# EasyEDA Pro project ProPrj_ODrive_2025-02-24.epro, schematic ODrive1_1

## Sheets
1 Controller: Board Name: ODrive1_2; Create Date: 2025-02-06; Page Name: Controller; Project Name: ODrive; Schematic Name: ODrive1_2; Update Date: 2025-02-06
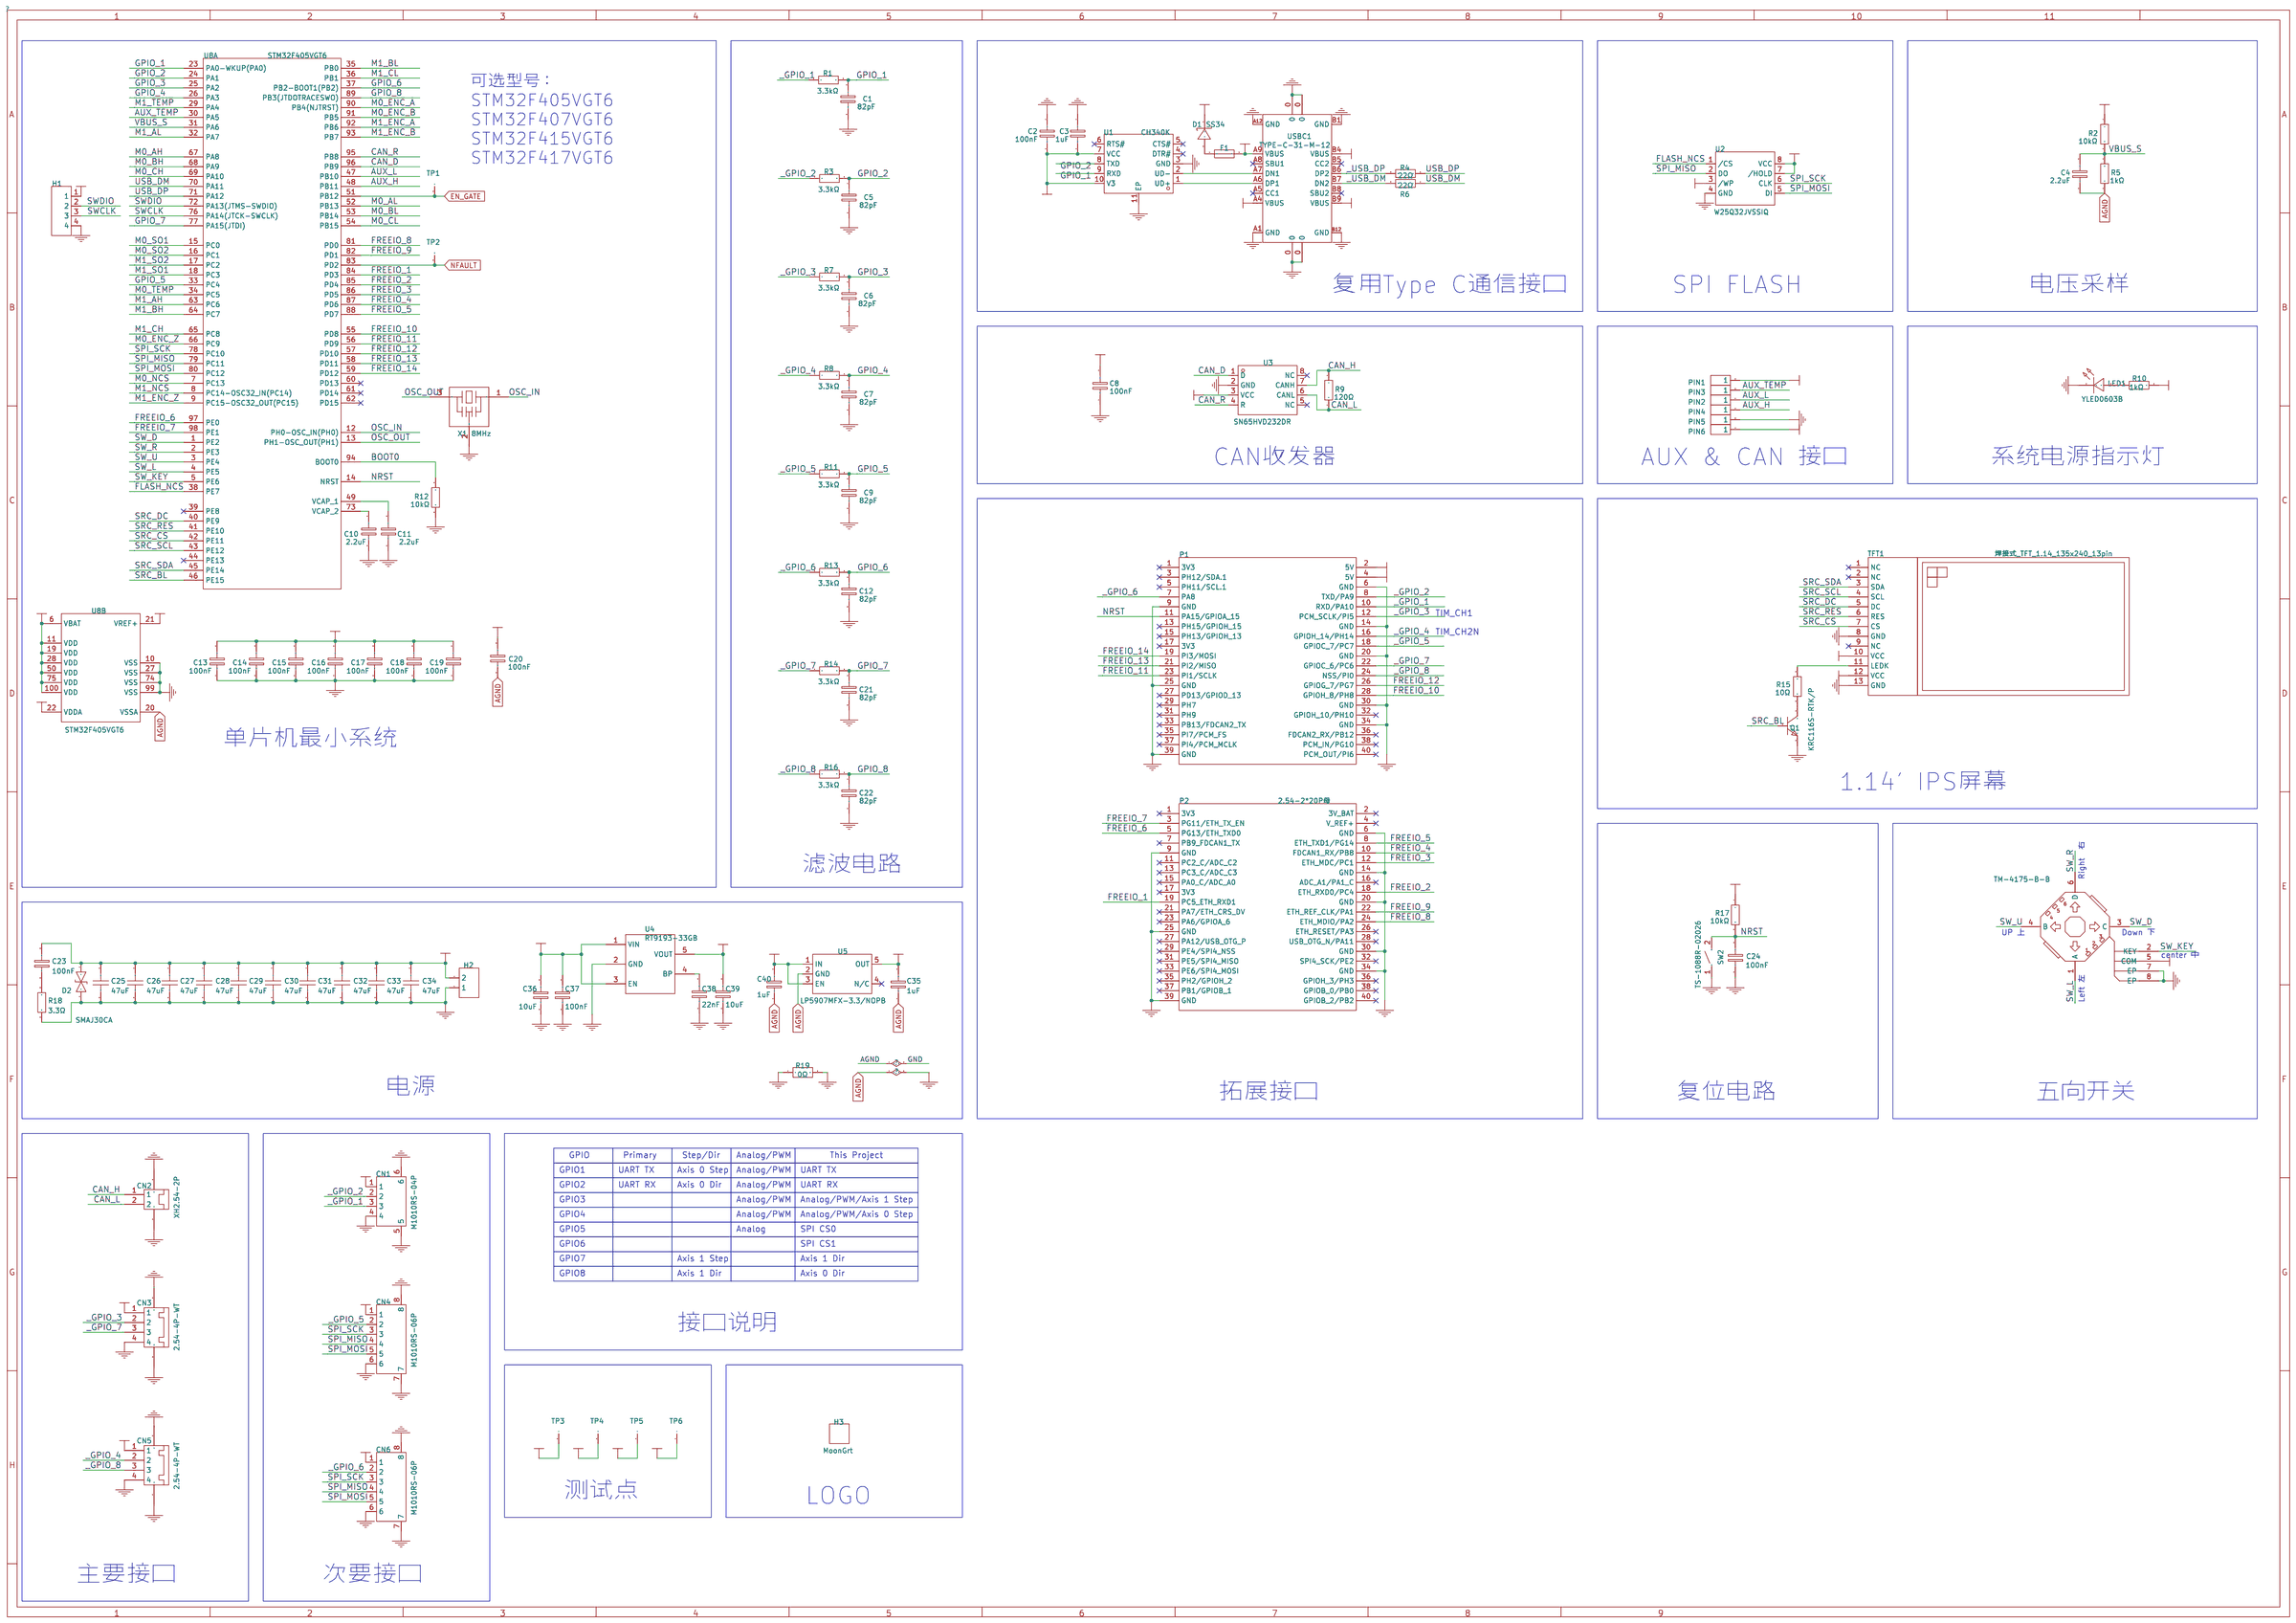
[diagram p0: Controller]
2 Motor: Page Name: Motor
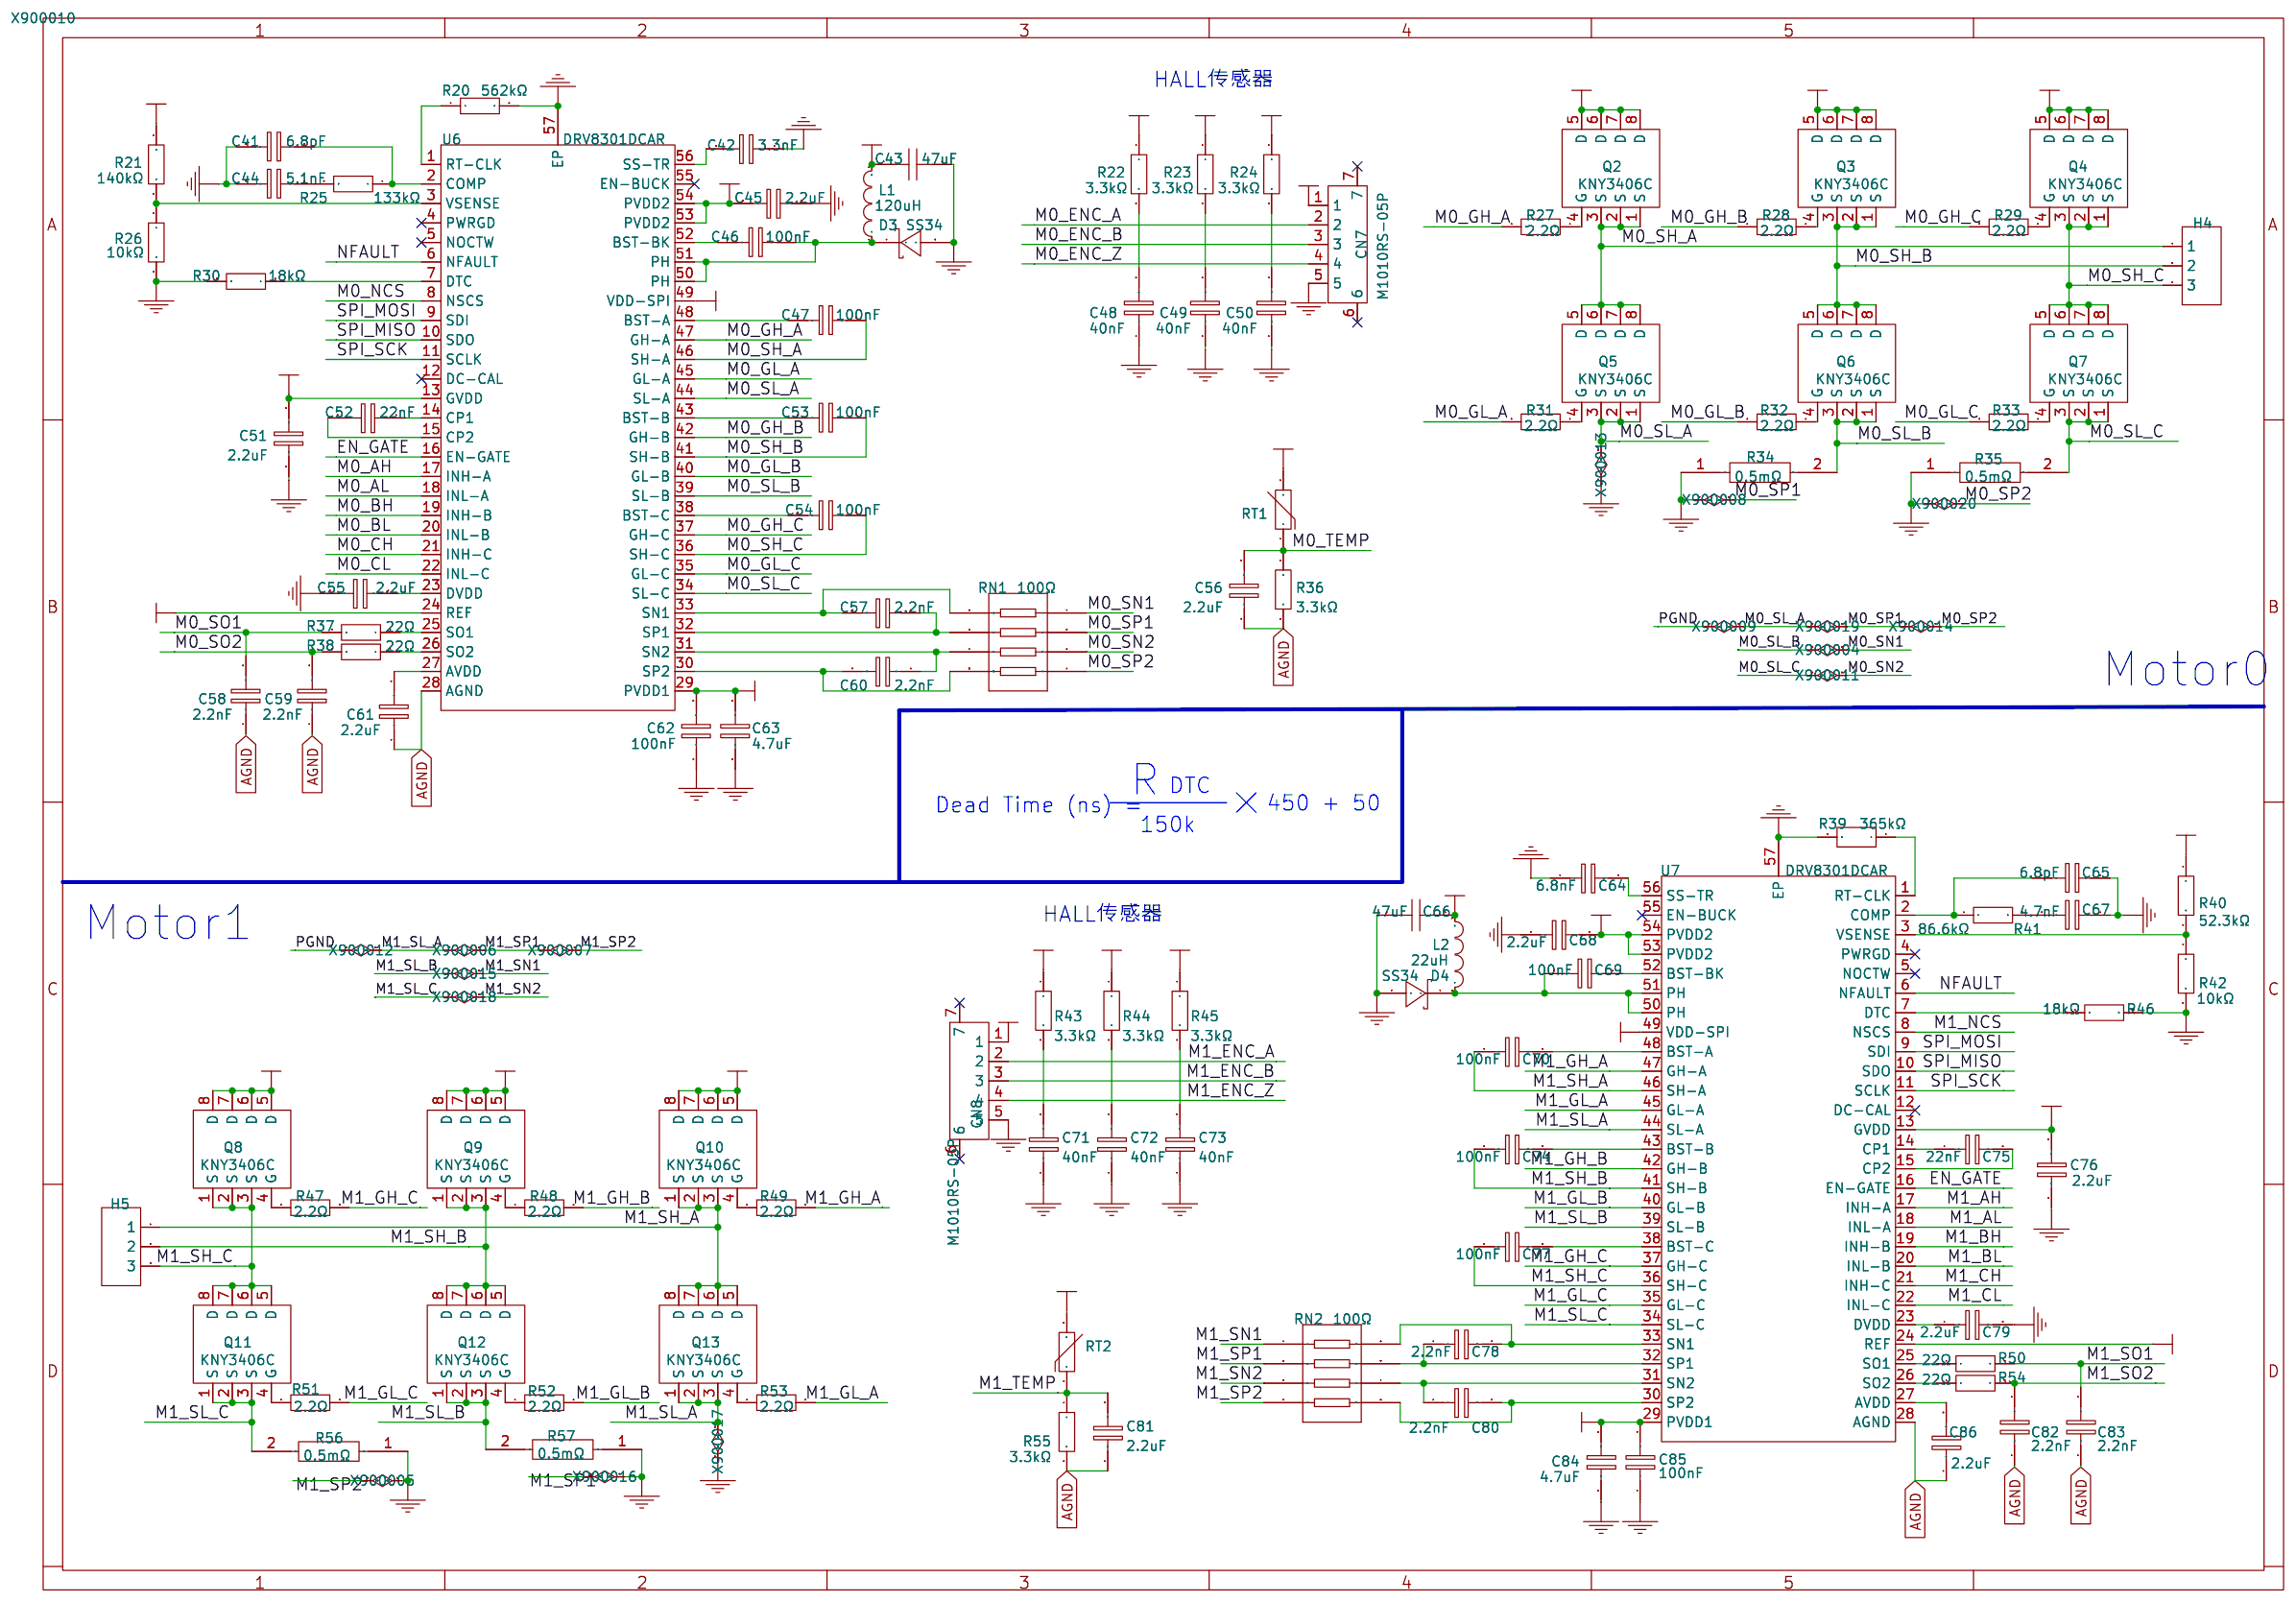
[diagram p1: Motor]

## Parts
sheet Controller
C1  82pF  [C0603]
C2  100nF  [C0603]
C3  1uF  [C0603]
C4  2.2uF  [C0603]
C5  82pF  [C0603]
C6  82pF  [C0603]
C7  82pF  [C0603]
C8  100nF  [C0603]
C9  82pF  [C0603]
C10  2.2uF  [C0603]
C11  2.2uF  [C0603]
C12  82pF  [C0603]
C13  100nF  [C0603]
C14  100nF  [C0603]
C15  100nF  [C0603]
C16  100nF  [C0603]
C17  100nF  [C0603]
C18  100nF  [C0603]
C19  100nF  [C0603]
C20  100nF  [C0603]
C21  82pF  [C0603]
C22  82pF  [C0603]
C23  100nF  [C0603]
C24  100nF  [C0603]
C25  47uF  [C1812]
C26  47uF  [C1812]
C27  47uF  [C1812]
C28  47uF  [C1812]
C29  47uF  [C1812]
C30  47uF  [C1812]
C31  47uF  [C1812]
C32  47uF  [C1812]
C33  47uF  [C1812]
C34  47uF  [C1812]
C35  1uF  [C0603]
C36  10uF  [C0603]
C37  100nF  [C0603]
C38  22nF  [C0603]
C39  10uF  [C0603]
C40  1uF  [C0603]
CN1  M1010RS-04P  [CONN-SMD_M1010RS-04P]
CN2  XH2.54-2P  [CONN-SMD_2.54-2P-WT]
CN3  2.54-4P-WT  [CONN-SMD_2.54-4P-WT]
CN4  M1010RS-06P  [CONN-SMD_M1010RS-06P]
CN5  2.54-4P-WT  [CONN-SMD_2.54-4P-WT]
CN6  M1010RS-06P  [CONN-SMD_M1010RS-06P]
D1  SS34  [SMA_L4.4-W2.8-LS5.4-RD]
D2  SMAJ30CA  [SMA_L4.4-W2.6-LS5.0-BI]
F1  FSMD012-1206-R  [F1206]
H1  PZ200V-11-04P  [HDR-TH_4P-P2.00-V-M]  (no BOM)
H2  XT30U-M  [XT30U-M]
H3  MoonGrt  [ODRIVE_LOGO_H3.5]  (no BOM)
LED1  YLED0603B  [LED0603_BLUE]
P1  2.54-2*20P母  [MY_HDR-TH_40P-P2.54-V-M-R2-C20-S2.54]
P2  2.54-2*20P母  [MY_HDR-TH_40P-P2.54-V-M-R2-C20-S2.54]
PIN1  1PIN  [1PIN]  (no BOM)
PIN2  1PIN  [1PIN]  (no BOM)
PIN3  1PIN  [1PIN]  (no BOM)
PIN4  1PIN  [1PIN]  (no BOM)
PIN5  1PIN  [1PIN]  (no BOM)
PIN6  1PIN  [1PIN]  (no BOM)
Q1  KRC116S-RTK/P  [SOT-23-3_L2.9-W1.6-P1.90-LS2.8-BR]
R1  3.3kΩ  [R0603]
R2  10kΩ  [R0603]
R3  3.3kΩ  [R0603]
R4  22Ω  [R0603]
R5  1kΩ  [R0603]
R6  22Ω  [R0603]
R7  3.3kΩ  [R0603]
R8  3.3kΩ  [R0603]
R9  120Ω  [R0603]
R10  1kΩ  [R0603]
R11  3.3kΩ  [R0603]
R12  10kΩ  [R0603]
R13  3.3kΩ  [R0603]
R14  3.3kΩ  [R0603]
R15  10Ω  [R0603]
R16  3.3kΩ  [R0603]
R17  10kΩ  [R0603]
R18  3.3Ω  [R0603]
R19  0Ω  [R0603]
SW1  TM-4175-B-B  [SW-SMD_TM-4175-B-B]
SW2  TS-1088R-02026  [SW-SMD_L3.9-W3.0-P4.45]
TFT1  焊接式_TFT_1.14_135x240_13pin  [焊接式_TFT_1.14_135X240_13PIN]
TP1  Testpoint 1.6mm  [TESTPOINT 1.6MM]  (no BOM)
TP2  Testpoint 1.6mm  [TESTPOINT 1.6MM]  (no BOM)
TP3  Testpoint 1.6mm  [TESTPOINT 1.6MM]  (no BOM)
TP4  Testpoint 1.6mm  [TESTPOINT 1.6MM]  (no BOM)
TP5  Testpoint 1.6mm  [TESTPOINT 1.6MM]  (no BOM)
TP6  Testpoint 1.6mm  [TESTPOINT 1.6MM]  (no BOM)
U1  CH340K  [ESOP-10_L4.9-W3.9-P1.00-LS6.2-BL-EP]
U2  W25Q32JVSSIQ  [SOIC-8_L5.3-W5.3-P1.27-LS8.0-BL]
U3  SN65HVD232DR  [SOIC-8_L5.0-W4.0-P1.27-LS6.0-BL]
U4  RT9193-33GB  [SOT-23-5_L3.0-W1.7-P0.95-LS2.8-BR]
U5  LP5907MFX-3.3/NOPB  [SOT-23-5_L3.0-W1.7-P0.95-LS2.8-BR]
U8  STM32F405VGT6  [LQFP-100_L14.0-W14.0-P0.50-LS16.0-BL]  (sections 1,2)
USBC1  TYPE-C-31-M-12  [USB-C_SMD-TYPE-C-31-M-12]
X1  8MHz  [OSC-SMD_3P-L3.2-W1.3-P1.20]
sheet Motor
C41  6.8pF  [C0603]
C42  3.3nF  [C0603]
C43  47uF  [C1812]
C44  5.1nF  [C0603]
C45  2.2uF  [C0603]
C46  100nF  [C0603]
C47  100nF  [C0603]
C48  40nF  [C0603]
C49  40nF  [C0603]
C50  40nF  [C0603]
C51  2.2uF  [C0603]
C52  22nF  [C0603]
C53  100nF  [C0603]
C54  100nF  [C0603]
C55  2.2uF  [C0603]
C56  2.2uF  [C0603]
C57  2.2nF  [C0603]
C58  2.2nF  [C0603]
C59  2.2nF  [C0603]
C60  2.2nF  [C0603]
C61  2.2uF  [C0603]
C62  100nF  [C0603]
C63  4.7uF  [C0603]
C64  6.8nF  [C0603]
C65  6.8pF  [C0603]
C66  47uF  [C1812]
C67  4.7nF  [C0603]
C68  2.2uF  [C0603]
C69  100nF  [C0603]
C70  100nF  [C0603]
C71  40nF  [C0603]
C72  40nF  [C0603]
C73  40nF  [C0603]
C74  100nF  [C0603]
C75  22nF  [C0603]
C76  2.2uF  [C0603]
C77  100nF  [C0603]
C78  2.2nF  [C0603]
C79  2.2uF  [C0603]
C80  2.2nF  [C0603]
C81  2.2uF  [C0603]
C82  2.2nF  [C0603]
C83  2.2nF  [C0603]
C84  4.7uF  [C0603]
C85  100nF  [C0603]
C86  2.2uF  [C0603]
CN7  M1010RS-05P  [CONN-SMD_M1010RS-05P]
CN8  M1010RS-05P  [CONN-SMD_M1010RS-05P]
D3  SS34  [SMA_L4.4-W2.8-LS5.4-RD]
D4  SS34  [SMA_L4.4-W2.8-LS5.4-RD]
H4  MR30-M  [MR30-M]
H5  MR30-M  [MR30-M]
L1  120uH  [IND-SMD_L6.0-W6.0]
L2  22uH  [IND-SMD_L6.0-W6.0]
Q2  KNY3406C  [PDFNWB-8L_L6.0-W5.0-P1.27-BL-EP_CON]
Q3  KNY3406C  [PDFNWB-8L_L6.0-W5.0-P1.27-BL-EP_CON]
Q4  KNY3406C  [PDFNWB-8L_L6.0-W5.0-P1.27-BL-EP_CON]
Q5  KNY3406C  [PDFNWB-8L_L6.0-W5.0-P1.27-BL-EP_CON]
Q6  KNY3406C  [PDFNWB-8L_L6.0-W5.0-P1.27-BL-EP_CON]
Q7  KNY3406C  [PDFNWB-8L_L6.0-W5.0-P1.27-BL-EP_CON]
Q8  KNY3406C  [PDFNWB-8L_L6.0-W5.0-P1.27-BL-EP_CON]
Q9  KNY3406C  [PDFNWB-8L_L6.0-W5.0-P1.27-BL-EP_CON]
Q10  KNY3406C  [PDFNWB-8L_L6.0-W5.0-P1.27-BL-EP_CON]
Q11  KNY3406C  [PDFNWB-8L_L6.0-W5.0-P1.27-BL-EP_CON]
Q12  KNY3406C  [PDFNWB-8L_L6.0-W5.0-P1.27-BL-EP_CON]
Q13  KNY3406C  [PDFNWB-8L_L6.0-W5.0-P1.27-BL-EP_CON]
R20  562kΩ  [R0603]
R21  140kΩ  [R0603]
R22  3.3kΩ  [R0603]
R23  3.3kΩ  [R0603]
R24  3.3kΩ  [R0603]
R25  133kΩ  [R0603]
R26  10kΩ  [R0603]
R27  2.2Ω  [R0603]
R28  2.2Ω  [R0603]
R29  2.2Ω  [R0603]
R30  18kΩ  [R0603]
R31  2.2Ω  [R0603]
R32  2.2Ω  [R0603]
R33  2.2Ω  [R0603]
R34  0.5mΩ  [R2512]
R35  0.5mΩ  [R2512]
R36  3.3kΩ  [R0603]
R37  22Ω  [R0603]
R38  22Ω  [R0603]
R39  365kΩ  [R0603]
R40  52.3kΩ  [R0603]
R41  86.6kΩ  [R0603]
R42  10kΩ  [R0603]
R43  3.3kΩ  [R0603]
R44  3.3kΩ  [R0603]
R45  3.3kΩ  [R0603]
R46  18kΩ  [R0603]
R47  2.2Ω  [R0603]
R48  2.2Ω  [R0603]
R49  2.2Ω  [R0603]
R50  22Ω  [R0603]
R51  2.2Ω  [R0603]
R52  2.2Ω  [R0603]
R53  2.2Ω  [R0603]
R54  22Ω  [R0603]
R55  3.3kΩ  [R0603]
R56  0.5mΩ  [R2512]
R57  0.5mΩ  [R2512]
RN1  100Ω  [RES-ARRAY-SMD_0603-8P-L3.2-W1.6-BL]
RN2  100Ω  [RES-ARRAY-SMD_0603-8P-L3.2-W1.6-BL]
RT1  NCP18XH103F03RB  [R0603]
RT2  NCP18XH103F03RB  [R0603]
U6  DRV8301DCAR  [HTSSOP-56_L14.0-W6.0-P0.50-LS8.0-BL]
U7  DRV8301DCAR  [HTSSOP-56_L14.0-W6.0-P0.50-LS8.0-BL]

## Library data of the parts
C1 C5-C7 C9 C12 C21 C22 = 0603CG820J500NT: 容值:82pF;精度:±5%;额定电压:50V;材质(温度系数):C0G;; LCSC Part Name: 82pF ±5% 50V; Supplier Part: C1683; Manufacturer: FH(风华); Supplier Footprint: 0603; JLCPCB Part Class: Extended Part; Datasheet: https://atta.szlcsc.com/upload/public/pdf/source/20200305/C486355_26A10D38EF8C2A5C37091D0039909270.pdf; Supplier: LCSC; Tolerance: ±5%; Voltage Rated: 50V; Temperature Coefficient: C0G
C2 C8 C13-C20 C23 C24 C37 C46 C47 C53 C54 C62 C69 C70 C74 C77 C85 = CC0603KRX7R9BB104: 容值:100nF;精度:±10%;额定电压:50V;材质(温度系数):X7R;; LCSC Part Name: 100nF ±10% 50V; Supplier Part: C14663; Manufacturer: YAGEO(国巨); Supplier Footprint: 0603; JLCPCB Part Class: Basic Part; Datasheet: https://atta.szlcsc.com/upload/public/pdf/source/20180910/C282072_33301C7F631E79921B82A8DAC6BCC5B3.pdf; Supplier: LCSC; Tolerance: ±10%; Voltage Rated: 50V; Temperature Coefficient: X7R
C3 C35 C40 = CL10A105KO8NNNC: 容值:1uF;精度:±10%;额定电压:16V;材质(温度系数):X5R;; LCSC Part Name: 1uF ±10% 16V; Supplier Part: C1592; Manufacturer: SAMSUNG(三星); Supplier Footprint: 0603; JLCPCB Part Class: Extended Part; Datasheet: https://atta.szlcsc.com/upload/public/pdf/source/20220919/9FBE606BE0D9532D730F292EB26DC5BB.pdf; Supplier: LCSC; Tolerance: ±10%; Voltage Rated: 16V; Temperature Coefficient: X5R
C4 C10 C11 C45 C51 C55 C56 C61 C68 C76 C79 C81 C86 = GRM188R61H225KE11D: 容值:2.2uF;精度:±10%;额定电压:50V;材质(温度系数):X5R;; LCSC Part Name: 2.2uF ±10% 50V; Supplier Part: C162273; Manufacturer: muRata(村田); Supplier Footprint: 0603; JLCPCB Part Class: Extended Part; Datasheet: https://atta.szlcsc.com/upload/public/pdf/source/20181211/C162273_A9C6FF7829784AEF50225F4680DD9126.pdf; Supplier: LCSC; Tolerance: ±10%; Voltage Rated: 50V; Temperature Coefficient: X5R
C25-C34 C43 C66 = C4532X5R1A476MT000N: 容值:47uF;精度:±20%;额定电压:10V;材质(温度系数):X5R;; LCSC Part Name: 47uF ±20% 10V; Supplier Part: C342615; Manufacturer: TDK; Supplier Footprint: 1812; JLCPCB Part Class: Extended Part; Datasheet: https://atta.szlcsc.com/upload/public/pdf/source/20190612/C361180_85CC9FB0751BEA97238DE56AB4AF0B1F.pdf; Supplier: LCSC; Tolerance: ±20%; Voltage Rated: 10V; Temperature Coefficient: X5R
C36 C39 = CL10A106MP8NNNC: 容值:10uF;精度:±20%;额定电压:10V;材质(温度系数):X5R;; LCSC Part Name: 10uF ±20% 10V; Supplier Part: C85713; Manufacturer: SAMSUNG(三星); Supplier Footprint: 0603; JLCPCB Part Class: Extended Part; Datasheet: https://atta.szlcsc.com/upload/public/pdf/source/20160218/1457707763339.pdf; Supplier: LCSC; Tolerance: ±20%; Voltage Rated: 10V; Temperature Coefficient: X5R
C38 C52 C75 = CL10B223KB8NNNC: 容值:22nF;精度:±10%;额定电压:50V;材质(温度系数):X7R;; LCSC Part Name: 22nF ±10% 50V; Supplier Part: C21122; Manufacturer: SAMSUNG(三星); Supplier Footprint: 0603; JLCPCB Part Class: Basic Part; Datasheet: https://atta.szlcsc.com/upload/public/pdf/source/20160218/1457707763339.pdf; Supplier: LCSC; Tolerance: ±10%; Voltage Rated: 50V; Temperature Coefficient: X7R
CN1 = M1010RS-04P: 插针结构:1x4P;间距:1mm;安装方式:卧贴;参考系列:-;总PIN数:4P;排数:1;每排PIN数:4;行距:-;额定电流:1A;工作温度范围:-25℃~+85℃;; LCSC Part Name: 1x4P 间距:1mm 卧贴; Supplier Part: C541846; Manufacturer: XFCN(兴飞); Supplier Footprint: SMD,P=1mm,卧贴; JLCPCB Part Class: Extended Part; Datasheet: https://atta.szlcsc.com/upload/public/pdf/source/20200518/C541847_4FBBB7CE1CCFE042AF6DD43CBAA42E89.pdf; Supplier: LCSC; Pins Structure: 1x4P; Pitch: 1mm; Mounting Style: 卧贴; Number of Pins: 4P; Number of Rows: 1; Number of PINs Per Row: 4; Current Rating (Max): 1A; Operating Temperature Range: -25℃~+85℃
CN2 = XH-5AW: Supplier: LCSC; Manufacturer: BOOMELE; image: //image.lceda.cn/szlcsc/C24023.jpg; Supplier Part: C24023; Paste Type: expand; Assembly Type: manualWeld
CN3 CN5 = 2.54-4P-WT: 插针结构:1x4P;间距:2.5mm;安装方式:卧贴;参考系列:XH;总PIN数:4P;排数:1;每排PIN数:4;行距:-;额定电流:500mA;工作温度范围:-25℃~+85℃;; LCSC Part Name: 1x4P 间距:2.5mm 卧贴 系列:XH; Supplier Part: C722701; Manufacturer: CAX(创都); Supplier Footprint: SMD,P=2.5mm,卧贴; JLCPCB Part Class: Extended Part; Datasheet: https://atta.szlcsc.com/upload/public/pdf/source/20200831/C722696_77A3476FAF7CFEE79ECA533977340414.pdf; Supplier: LCSC; Pins Structure: 1x4P; Pitch: 2.5mm; Mounting Style: 卧贴; Reference Series: XH; Number of Pins: 4P; Number of Rows: 1; Number of PINs Per Row: 4; Current Rating (Max): 500mA; Operating Temperature Range: -25℃~+85℃
CN4 CN6 = M1010RS-06P: 插针结构:1x6P;间距:1mm;安装方式:卧贴;参考系列:-;总PIN数:6P;排数:1;每排PIN数:6;行距:-;额定电流:1A;工作温度范围:-25℃~+85℃;; LCSC Part Name: 1x6P 间距:1mm 卧贴; Supplier Part: C541848; Manufacturer: XFCN(兴飞); Supplier Footprint: SMD,P=1mm,卧贴; JLCPCB Part Class: Extended Part; Datasheet: https://atta.szlcsc.com/upload/public/pdf/source/20200518/C541847_4FBBB7CE1CCFE042AF6DD43CBAA42E89.pdf; Supplier: LCSC; Pins Structure: 1x6P; Pitch: 1mm; Mounting Style: 卧贴; Number of Pins: 6P; Number of Rows: 1; Number of PINs Per Row: 6; Current Rating (Max): 1A; Operating Temperature Range: -25℃~+85℃
D1 D3 D4 = SS34_C142458: 正向压降(Vf):500mV@3A;直流反向耐压(Vr):40V;平均整流电流(Io):3A;; LCSC Part Name: 电压:40V 电流:3A; Supplier Part: C142458; Supplier Footprint: SMA(DO-214AC); JLCPCB Part Class: Extended Part; Datasheet: https://atta.szlcsc.com/upload/public/pdf/source/20171114/C142458_15106326937931117548.pdf; Supplier: LCSC; Forward Voltage (Vf@If): 500mV@3A; Reverse Voltage (Vr): 40V; Average Rectified Current (Io): 3A
D2 = SMAJ30CA_C266339: 反向截止电压(Vrwm):30V;最大钳位电压:48.4V;峰值脉冲电流(Ipp):8.3A;峰值脉冲功率(Ppp):400W;击穿电压:33.3V;; LCSC Part Name: 双向TVS 30V截止 8.3A峰值脉冲; Supplier Part: C266339; Manufacturer: GOOD-ARK(固锝); Supplier Footprint: SMA(DO-214AC); JLCPCB Part Class: Extended Part; Datasheet: https://atta.szlcsc.com/upload/public/pdf/source/20181218/C266339_E2F84BC65B90D6C192327DA52037B2A6.pdf; Supplier: LCSC; Reverse Stand-Off Voltage (Vrwm): 30V; Maximum Clamping Voltage: 48.4V; Peak Pulse Current (Ipp): 8.3A; Peak Pulse Power Dissipation (Ppp): 400W; Breakdown Voltage: 33.3V; Reverse Leakage Current (Ir): 1uA; Type: TVS
F1 = FSMD012-1206-R: 最大电压:48V;最大电流:100A;保持电流:120mA;跳闸电流:390mA;; LCSC Part Name: 48V 120mA 1206自恢复; Supplier Part: C220144; Manufacturer: FUZETEC(富致); Supplier Footprint: 1206; JLCPCB Part Class: Extended Part; Datasheet: https://atta.szlcsc.com/upload/public/pdf/source/20180530/C220148_049DD1B3B45E5B13B513EB60E97CECB8.pdf; Supplier: LCSC; Operating Voltage (Max): 48V; Current Rating (Max): 100A; Hold Current: 120mA; Trip Current: 390mA
H1 = PZ200V-11-04P: Supplier: LCSC; Supplier Part: C541858; Manufacturer: XFCN; JLCPCB SMD: Yes; JLCPCB Part Class: Extend
H2 = XT30U-M: Supplier Part: C99101; Supplier: LCSC; Manufacturer: AMASS(艾迈斯)
H3 = Hole-3mm
LED1 = YLED0603B: 发光颜色:蓝色;正向电压(VF):2.6V~3.2V;功率:-;正向电流:30mA;主波长:460nm~475nm;发光角度:120°;工作温度:-40℃~+85℃;; Supplier Part: C19171394; Manufacturer: YONGYUTAI(永裕泰); Supplier Footprint: 0603; JLCPCB Part Class: Extended Part; Datasheet: https://atta.szlcsc.com/upload/public/pdf/source/20231027/6134FF4BA718E32A802654BBC76F69A6.pdf; Supplier: LCSC; Emitted Color: 蓝色; Forward Voltage (VF): 2.6V~3.2V; Forward Current: 30mA; Dominant Wavelength: 460nm~475nm; Viewing Angle: 120°; Operating Temperature: -40℃~+85℃
P1 P2 = 2.54-2*20P母: 插孔结构:2x20P;间距:2.54mm;行距:2.54mm;安装类型:直插;排数:双排;总孔位数:40P;塑高:-;触头材质:黄铜;触头镀层:-;; LCSC Part Name: 间距:2.54mm 2x20P 直插; Supplier Part: C50982; Manufacturer: BOOMELE(博穆精密); Supplier Footprint: 插件,P=2.54mm; JLCPCB Part Class: Extended Part; Supplier: LCSC; Holes Structure: 2x20P; Pitch: 2.54mm; Row Spacing: 2.54mm; Mounting Type: 直插; Number of Rows: 双排; Number of Holes: 40P; Contact Material: 黄铜
PIN1-PIN6 = 1PIN
Q1 = KRC116S-RTK/P: 晶体管类型:-;集射极击穿电压(Vceo):50V;集电极电流(Ic):100mA;功率(Pd):200mW;; LCSC Part Name: 耐压:50V 电流:100mA; Supplier Part: C125283; Manufacturer: KEC; Supplier Footprint: SOT-23; JLCPCB Part Class: Extended Part; Datasheet: https://atta.szlcsc.com/upload/public/pdf/source/20170814/C125285_1502678179881885598.pdf; Supplier: LCSC; Collector-Emitter Breakdown Voltage (Vceo): 50V; Collector Current (Ic): 100mA; Power Dissipation (Pd): 200mW
R1 R3 R7 R8 R11 R13 R14 R16 R22-R24 R36 R43-R45 R55 = 0603WAF3301T5E: 电阻类型:厚膜电阻;阻值:3.3kΩ;精度:±1%;功率:100mW;最大工作电压:75V;温度系数:±100ppm/℃;; LCSC Part Name: 3.3kΩ ±1% 100mW 厚膜电阻; Supplier Part: C22978; Manufacturer: UNI-ROYAL(厚声); Supplier Footprint: 0603; JLCPCB Part Class: Basic Part; Datasheet: https://atta.szlcsc.com/upload/public/pdf/source/20200306/C422600_1E6D84923E4A46A82E41ADD87F860B5C.pdf; Supplier: LCSC; Type: 厚膜电阻; Tolerance: ±1%; Power(Watts): 100mW; Overload Voltage (Max): 75V; Temperature Coefficient: ±100ppm/℃; Operating Temperature Range: -55℃~+155℃
R2 R12 R17 R26 R42 = RC0603FR-0710KL: 电阻类型:厚膜电阻;阻值:10kΩ;精度:±1%;功率:100mW;最大工作电压:75V;温度系数:±100ppm/℃;; LCSC Part Name: 厚膜电阻 10kΩ ±1% 100mW; Supplier Part: C98220; Manufacturer: YAGEO(国巨); Supplier Footprint: 0603; JLCPCB Part Class: Extended Part; Datasheet: https://atta.szlcsc.com/upload/public/pdf/source/20180927/C295883_E8D83085EA81BD7DE0B2B681138C15EE.pdf; Supplier: LCSC; Type: 厚膜电阻; Tolerance: ±1%; Power(Watts): 100mW; Overload Voltage (Max): 75V; Temperature Coefficient: ±100ppm/℃; Operating Temperature Range: -55℃~+155℃
R4 R6 R37 R38 R50 R54 = ARG03FTC0220: 电阻类型:薄膜电阻;阻值:22Ω;精度:±1%;功率:100mW;最大工作电压:75V;温度系数:±25ppm/℃;; LCSC Part Name: 薄膜电阻 22Ω ±1% 100mW; Supplier Part: C217888; Manufacturer: Viking(光颉); Supplier Footprint: 0603; JLCPCB Part Class: Extended Part; Datasheet: https://atta.szlcsc.com/upload/public/pdf/source/20200117/C485675_99063924B4564AF910B7BE66DA8EFA49.pdf; Supplier: LCSC; Type: 薄膜电阻; Tolerance: ±1%; Power(Watts): 100mW; Overload Voltage (Max): 75V; Temperature Coefficient: ±25ppm/℃; Operating Temperature Range: -55℃~+155℃
R5 R10 = RT0603FRE071KL: 电阻类型:薄膜电阻;阻值:1kΩ;精度:±1%;功率:100mW;最大工作电压:75V;温度系数:±50ppm/℃;; LCSC Part Name: 薄膜电阻 1kΩ ±1% 100mW; Supplier Part: C375503; Manufacturer: YAGEO(国巨); Supplier Footprint: 0603; JLCPCB Part Class: Extended Part; Datasheet: https://atta.szlcsc.com/upload/public/pdf/source/20190227/C375503_9EB26A65C07F9B8645B441605E668894.pdf; Supplier: LCSC; Type: 薄膜电阻; Tolerance: ±1%; Power(Watts): 100mW; Overload Voltage (Max): 75V; Temperature Coefficient: ±50ppm/℃; Operating Temperature Range: -55℃~+155℃
R9 = HPCR0603F120RK9: 电阻类型:厚膜电阻;阻值:120Ω;精度:±1%;功率:-;最大工作电压:50V;温度系数:±100ppm/℃;; LCSC Part Name: 厚膜电阻 120Ω ±1%; Supplier Part: C365072; Manufacturer: RESI(开步睿思); Supplier Footprint: 0603; JLCPCB Part Class: Extended Part; Datasheet: https://atta.szlcsc.com/upload/public/pdf/source/20200302/C492020_A67DFE56E3A0098A28FA0495227278A6.pdf; Supplier: LCSC; Type: 厚膜电阻; Tolerance: ±1%; Overload Voltage (Max): 50V; Temperature Coefficient: ±100ppm/℃; Operating Temperature Range: -55℃~+125℃
R15 = QR0603J10R0P05Z: 电阻类型:厚膜电阻;阻值:10Ω;精度:±5%;功率:100mW;最大工作电压:75V;温度系数:±100ppm/℃;; LCSC Part Name: 厚膜电阻 10Ω ±5% 100mW; Supplier Part: C176153; Manufacturer: EVER OHMS(天二科技); Supplier Footprint: 0603; JLCPCB Part Class: Extended Part; Datasheet: https://atta.szlcsc.com/upload/public/pdf/source/20190816/C191725_FB5BDDD87CE7DE7F0F741FE894220CBC.pdf; Supplier: LCSC; Type: 厚膜电阻; Tolerance: ±5%; Power(Watts): 100mW; Overload Voltage (Max): 75V; Temperature Coefficient: ±100ppm/℃; Operating Temperature Range: -55℃~+155℃
R18 = 0603WAF330KT5E: 电阻类型:厚膜电阻;阻值:3.3Ω;精度:±1%;功率:100mW;最大工作电压:75V;温度系数:±400ppm/℃;; LCSC Part Name: 3.3Ω ±1% 100mW 厚膜电阻; Supplier Part: C22979; Manufacturer: UNI-ROYAL(厚声); Supplier Footprint: 0603; JLCPCB Part Class: Extended Part; Datasheet: https://atta.szlcsc.com/upload/public/pdf/source/20200306/C422600_1E6D84923E4A46A82E41ADD87F860B5C.pdf; Supplier: LCSC; Type: 厚膜电阻; Tolerance: ±1%; Power(Watts): 100mW; Overload Voltage (Max): 75V; Temperature Coefficient: ±400ppm/℃; Operating Temperature Range: -55℃~+155℃
R19 = 0603WAJ0000T5E: 电阻类型:厚膜电阻;阻值:0Ω;精度:±5%;功率:100mW;最大工作电压:75V;温度系数:±800ppm/℃;; LCSC Part Name: 0Ω ±5% 100mW 厚膜电阻; Supplier Part: C15402; Manufacturer: UNI-ROYAL(厚声); Supplier Footprint: 0603; JLCPCB Part Class: Extended Part; Datasheet: https://atta.szlcsc.com/upload/public/pdf/source/20200306/C422600_1E6D84923E4A46A82E41ADD87F860B5C.pdf; Supplier: LCSC; Type: 厚膜电阻; Tolerance: ±5%; Power(Watts): 100mW; Overload Voltage (Max): 75V; Temperature Coefficient: ±800ppm/℃; Operating Temperature Range: -55℃~+155℃
SW1 = TM-4175-B-B: 7.5*7.5*6五向开关 H6 升级减少摇晃 显示器五向开关; LCSC Part Name: 7.5*7.5*6五向开关 H6 升级减少摇晃 显示器五向开关; Supplier Part: C465996; Manufacturer: XKB Connection(中国星坤); Supplier Footprint: SMD-8P,7.5x7.5mm; JLCPCB Part Class: Extended Part; Datasheet: https://atta.szlcsc.com/upload/public/pdf/source/20211011/A0F6117F2AB0E02F6CF3847B7456F266.pdf; Supplier: LCSC
SW2 = TS-1088R-02026: 电路结构:单刀单掷;按钮形状:圆形按钮;安装方式:立贴;开关长度:3.9mm;开关宽度:2.93mm;开关高度:2mm;触点电流:50mA;额定电压(DC):12V;带灯:-;机械寿命:-;; LCSC Part Name: 3.9*2.93*2mm 立贴 轻触开关; Supplier Part: C455280; Manufacturer: XUNPU(讯普); Supplier Footprint: SMD,3x4mm; JLCPCB Part Class: Extended Part; Datasheet: https://atta.szlcsc.com/upload/public/pdf/source/20191118/C455281_EC5379764BC1462550DF64BBBFEA9579.pdf; Supplier: LCSC; Circuit: 单刀单掷; Actuator Style: 圆形按钮; Mounting Style: 立贴; Switch Length: 3.9mm; Switch Width: 2.93mm; Switch Height: 2mm; Contact Current: 50mA; Voltage Rating (DC): 12V
TFT1 = 焊接式_TFT_1.14_135x240_13pin
TP1-TP6 = Testpoint 1.6mm
U1 = CH340K: 应用功能:USB转串口;接口协议:USB 2.0;通道数:-;数据速率:2Mbps;; LCSC Part Name: USB转串口芯片CH340; Supplier Part: C968586; Manufacturer: WCH(南京沁恒); Supplier Footprint: ESSOP-10-150mil-1mm; JLCPCB Part Class: Extended Part; Datasheet: https://atta.szlcsc.com/upload/public/pdf/source/20240313/C21A12AB66F63ABF8F8743FF13A35C95.pdf; Supplier: LCSC; Applications Function: USB转串口; Protocol: USB 2.0; Supply Voltage: 3.3V；5V; Data Rate: 2Mbps; Operating Temperature: -20℃~+70℃
U2 = W25Q32JVSSIQ_C82344: 接口类型:SPI;存储容量:32Mbit;时钟频率(fc):133MHz;; Supplier Part: C82344; Manufacturer: WINBOND(华邦); Supplier Footprint: SOIC-8-208mil; JLCPCB Part Class: Extended Part; Datasheet: https://atta.szlcsc.com/upload/public/pdf/source/20160910/1473490310454.pdf; Supplier: LCSC; Interface Type: SPI; Memory Size: 32Mbit; Supply Voltage: 2.7V~3.6V; Page Programming Time (Tpp): 3ms; Operating Temperature: -40℃~+85℃; Interface: SPI; Clock Frequency: 133MHz; Voltage - Supply: 2.7V~3.6V; Block Erase Time(tBE): 120ms@(32KB); Data Retention - TDR (Year): 20年
U3 = SN65HVD232DR: 类型:CAN收发器;数据速率:1Mbps;; LCSC Part Name: 3.3-V CAN 收发器; Supplier Part: C30530; Manufacturer: TI(德州仪器); Supplier Footprint: SOIC-8; JLCPCB Part Class: Extended Part; Datasheet: https://www.ti.com/cn/lit/gpn/sn65hvd230; Supplier: LCSC; Type: CAN收发器; Data Rate: 1Mbps; Supply Voltage: 3.6V~7.5V; Supply Current: 370uA; Operating Temperature: -40℃~+85℃; JLCPCB SMD: Yes; image: //image.lceda.cn/szlcsc/C30530.jpg
U4 = RT9193-33GB: 输出类型:固定;最大输入电压:5.5V;输出电压:3.3V;输出电流:300mA;电源纹波抑制比(PSRR):70dB@(100Hz)；50dB@(10kHz);输出极性:正极;; LCSC Part Name: 输入5.5V 输出3.3V 300mA; Supplier Part: C15651; Manufacturer: RICHTEK(立锜); Supplier Footprint: SOT-23-5; JLCPCB Part Class: Extended Part; Datasheet: https://atta.szlcsc.com/upload/public/pdf/source/20130730/1457706628575.pdf; Supplier: LCSC; Output Type: 固定; Maximum Input Voltage: 5.5V; Output Voltage: 3.3V; Output Current: 300mA; Power Supply Rejection Ratio (PSRR): 70dB@(100Hz)；50dB@(10kHz); Dropout Voltage: 300mV@(300mA); standby current: 130uA; Feature: 防静电保护；低ESR；热保护(TSD)；过流保护(OCP)；带使能; Operating Temperature: -40℃~+125℃; Output Polarity: 正极; Number of Outputs: 1
U5 = LP5907MFX-3.3/NOPB: 输出类型:固定;最大输入电压:5.5V;输出电压:3.3V;输出电流:250mA;电源纹波抑制比(PSRR):90dB@(100Hz)；60dB@(100kHz);输出极性:正极;; LCSC Part Name: 具有低 IQ 和使能功能的 250mA、低噪声、高 PSRR、超低压降稳压器; Supplier Part: C80670; Manufacturer: TI(德州仪器); Supplier Footprint: SOT-23-5; JLCPCB Part Class: Extended Part; Datasheet: https://www.ti.com/cn/lit/gpn/lp5907; Supplier: LCSC; Output Type: 固定; Maximum Input Voltage: 5.5V; Output Voltage: 3.3V; Output Current: 250mA; Power Supply Rejection Ratio (PSRR): 90dB@(100Hz)；60dB@(100kHz); Dropout Voltage: 250mV@(250mA); standby current: 25uA; Feature: 防静电保护；短路保护；自动放电功能；低ESR；热保护(TSD)；欠压闭锁；带使能; Operating Temperature: -40℃~+125℃; Output Polarity: 正极; Number of Outputs: 1; JLCPCB SMD: Yes
U8 = STM32F405VGT6: CPU内核:ARM-M4;程序存储容量:1MB;RAM总容量:192KB;GPIO端口数量:82;工作电压范围:1.8V~3.6V;CPU最大主频:168MHz;程序存储器类型:FLASH;; LCSC Part Name: 带DSP和FPU的高性能基础系列ARM Cortex-M4 MCU，具有1 MB Flash、168 MHz CPU、ART加速器和FSMC; Supplier Part: C56621; Manufacturer: ST(意法半导体); Supplier Footprint: LQFP-100(14x14); JLCPCB Part Class: 扩展库; Datasheet: https://atta.szlcsc.com/upload/public/pdf/source/20150910/1457707351424.pdf; Supplier: LCSC; CPU Core: ARM-M4; Program Storage Size: 1MB; RAM Size: 192KB; GPIO Ports Number: 82; Operating Voltage Range: 1.8V~3.6V; CPU Maximum Speed: 168MHz; Program Memory Type: FLASH; Operating Temperature Range: -40℃~+85℃; ADC (Bit): 12bit; DAC (Bit): 12bit; Universal Serial Bus: 有; Peripheral/Function: DMA；LCD/LED驱动；PWM; Watchdog: 有; Infrared Data Association: 有; Low-Voltage Detect: 有; LCD Module: 有; Direct Memory Access: 有; Internal Oscillator: 有
USBC1 = TYPE-C-31-M-12: 连接器类型:Type-C;标准:-;公母:母;安装方式:-;触点数量:16P;端口数量:1;额定电流 - 电源:5A;工作温度范围:-;; LCSC Part Name: Type-C 母; Supplier Part: C165948; Manufacturer: 韩国韩荣; Supplier Footprint: SMD; JLCPCB Part Class: Extended Part; Datasheet: https://atta.szlcsc.com/upload/public/pdf/source/20220525/466408E853115E789EDB0DDC29077C05.pdf; Supplier: LCSC; Connector Type: Type-C; Gender: 母; Number of Contacts: 16P; Number of Ports: 1; Current Rating - Power (Max): 5A
X1 = CSTNE8M00G520000R0: 频率:8MHz;内置负载电容:10pF;谐振阻抗:40Ω;; LCSC Part Name: 8MHz ±0.5% 内置负载电容:10pF; Supplier Part: C907975; Manufacturer: muRata(村田); Supplier Footprint: SMD3213-3P; JLCPCB Part Class: Extended Part; Datasheet: https://atta.szlcsc.com/upload/public/pdf/source/20201022/C907975_BE77A173E35C03920A12013DDB2B8858.pdf; Supplier: LCSC; Built-in Load Capacitance: 10pF; Resonant Impedance: 40Ω; Operating Temperature: -40℃~+85℃
C41 C65 = 0603CG6R8C500NT: 容值:6.8pF;额定电压:50V;材质(温度系数):C0G;; LCSC Part Name: 6.8pF 50V; Supplier Part: C1679; Manufacturer: FH(风华); Supplier Footprint: 0603; JLCPCB Part Class: Extended Part; Datasheet: https://atta.szlcsc.com/upload/public/pdf/source/20200305/C486355_26A10D38EF8C2A5C37091D0039909270.pdf; Supplier: LCSC; Voltage Rated: 50V; Temperature Coefficient: C0G
C42 = 0603B332K500NT: 容值:3.3nF;精度:±10%;额定电压:50V;材质(温度系数):X7R;; LCSC Part Name: 3.3nF ±10% 50V; Supplier Part: C92203; Manufacturer: FH(风华); Supplier Footprint: 0603; JLCPCB Part Class: Extended Part; Datasheet: https://atta.szlcsc.com/upload/public/pdf/source/20200305/C486355_26A10D38EF8C2A5C37091D0039909270.pdf; Supplier: LCSC; Tolerance: ±10%; Voltage Rated: 50V; Temperature Coefficient: X7R
C44 = 0603B512K500NT: 容值:5.1nF;精度:±10%;额定电压:50V;材质(温度系数):X7R;; LCSC Part Name: 5.1nF ±10% 50V; Supplier Part: C1587; Manufacturer: FH(风华); Supplier Footprint: 0603; JLCPCB Part Class: Extended Part; Datasheet: https://atta.szlcsc.com/upload/public/pdf/source/20200305/C486355_26A10D38EF8C2A5C37091D0039909270.pdf; Supplier: LCSC; Tolerance: ±10%; Voltage Rated: 50V; Temperature Coefficient: X7R
C48-C50 C71-C73 = 0603B403K500NT: 容值:40nF;精度:±10%;额定电压:50V;材质(温度系数):X7R;; LCSC Part Name: 40nF ±10% 50V; Supplier Part: C41782; Manufacturer: FH(风华); Supplier Footprint: 0603; JLCPCB Part Class: Extended Part; Datasheet: https://atta.szlcsc.com/upload/public/pdf/source/20200305/C486355_26A10D38EF8C2A5C37091D0039909270.pdf; Supplier: LCSC; Tolerance: ±10%; Voltage Rated: 50V; Temperature Coefficient: X7R
C57-C60 C78 C80 C82 C83 = 0603B222K500NT: 容值:2.2nF;精度:±10%;额定电压:50V;材质(温度系数):X7R;; LCSC Part Name: 2.2nF ±10% 50V; Supplier Part: C1604; Manufacturer: FH(风华); Supplier Footprint: 0603; JLCPCB Part Class: Basic Part; Datasheet: https://atta.szlcsc.com/upload/public/pdf/source/20200305/C486355_26A10D38EF8C2A5C37091D0039909270.pdf; Supplier: LCSC; Tolerance: ±10%; Voltage Rated: 50V; Temperature Coefficient: X7R
C63 C84 = CL10A475KL8NRNC: 容值:4.7uF;精度:±10%;额定电压:35V;材质(温度系数):X5R;; LCSC Part Name: 4.7uF ±10% 35V; Supplier Part: C307467; Manufacturer: SAMSUNG(三星); Supplier Footprint: 0603; JLCPCB Part Class: Extended Part; Datasheet: https://atta.szlcsc.com/upload/public/pdf/source/20160218/1457707763339.pdf; Supplier: LCSC; Tolerance: ±10%; Voltage Rated: 35V; Temperature Coefficient: X5R
C64 = 0603B682K500NT: 容值:6.8nF;精度:±10%;额定电压:50V;材质(温度系数):X7R;; LCSC Part Name: 6.8nF ±10% 50V; Supplier Part: C1631; Manufacturer: FH(风华); Supplier Footprint: 0603; JLCPCB Part Class: Basic Part; Datasheet: https://atta.szlcsc.com/upload/public/pdf/source/20200305/C486355_26A10D38EF8C2A5C37091D0039909270.pdf; Supplier: LCSC; Tolerance: ±10%; Voltage Rated: 50V; Temperature Coefficient: X7R
C67 = CC0603KRX7R9BB472: 容值:4.7nF;精度:±10%;额定电压:50V;材质(温度系数):X7R;; LCSC Part Name: 4.7nF ±10% 50V; Supplier Part: C106218; Manufacturer: YAGEO(国巨); Supplier Footprint: 0603; JLCPCB Part Class: Extended Part; Datasheet: https://atta.szlcsc.com/upload/public/pdf/source/20180910/C282072_33301C7F631E79921B82A8DAC6BCC5B3.pdf; Supplier: LCSC; Tolerance: ±10%; Voltage Rated: 50V; Temperature Coefficient: X7R
CN7 CN8 = M1010RS-05P: 插针结构:1x5P;间距:1mm;安装方式:卧贴;参考系列:-;总PIN数:5P;排数:1;每排PIN数:5;行距:-;额定电流:1A;工作温度范围:-25℃~+85℃;; LCSC Part Name: 1x5P 间距:1mm 卧贴; Supplier Part: C541847; Manufacturer: XFCN(兴飞); Supplier Footprint: SMD,P=1mm,卧贴; JLCPCB Part Class: Extended Part; Datasheet: https://atta.szlcsc.com/upload/public/pdf/source/20200518/C541847_4FBBB7CE1CCFE042AF6DD43CBAA42E89.pdf; Supplier: LCSC; Pins Structure: 1x5P; Pitch: 1mm; Mounting Style: 卧贴; Number of Pins: 5P; Number of Rows: 1; Number of PINs Per Row: 5; Current Rating (Max): 1A; Operating Temperature Range: -25℃~+85℃
H4 H5 = MR30-M: Supplier Part: C99873; Supplier: LCSC; Manufacturer: AMASS(艾迈斯)
L1 = FNR6045S121MT: 电感值:120uH;精度:±20%;额定电流:850mA;饱和电流(Isat):940mA;; LCSC Part Name: 120uH ±20% 940mA; Supplier Part: C168096; Manufacturer: cjiang(长江微电); Supplier Footprint: SMD,6x6mm; JLCPCB Part Class: Extended Part; Datasheet: https://atta.szlcsc.com/upload/public/pdf/source/20190327/C167925_9EFF0AABC4CA629C2CC95961DBF7D39D.pdf; Supplier: LCSC; Tolerance: ±20%; Rated Current: 850mA; Saturation Current (Isat): 940mA; DC Resistance (DCR): 629mΩ
L2 = SWPA6028S220MT: 电感值:22uH;精度:±20%;额定电流:1.4A;饱和电流(Isat):1.45A;类型:-;; LCSC Part Name: 22uH ±20% 1.45A; Supplier Part: C51349; Manufacturer: Sunlord(顺络); Supplier Footprint: SMD; JLCPCB Part Class: Extended Part; Datasheet: https://atta.szlcsc.com/upload/public/pdf/source/20231024/317626D2AA2F8AB4113C1875E432E6E1.pdf; Supplier: LCSC; Tolerance: ±20%; Rated Current: 1.4A; Saturation Current (Isat): 1.45A; DC Resistance (DCR): 140mΩ
Q2-Q13 = KNY3406C: 类型:1个N沟道;漏源电压(Vdss):60V;连续漏极电流(Id):80A;导通电阻(RDS(on)@Vgs,Id):7mΩ@10V,10A;功率:41W;阈值电压(Vgs(th)@Id):1.3V@250uA;; LCSC Part Name: 1个N沟道 耐压:60V 电流:80A; Supplier Part: C455987; Manufacturer: KIA; Supplier Footprint: PDFN-8(5.8x4.9); JLCPCB Part Class: Extended Part; Datasheet: https://atta.szlcsc.com/upload/public/pdf/source/20191114/C455987_5B27682C33C31BB0F5A9BF4BAD1962A9.pdf; Supplier: LCSC; Type: 1个N沟道; Drain Source Voltage (Vdss): 60V; Continuous Drain Current (Id): 80A; Drain Source On Resistance (RDS(on)@Vgs,Id): 7mΩ@10V,10A; Power Dissipation (Pd): 41W; Gate Threshold Voltage (Vgs(th)@Id): 1.3V@250uA; Total Gate Charge (Qg@Vgs): 55nC@10V; Input Capacitance (Ciss@Vds): 3.3nF; Reverse Transfer Capacitance (Crss@Vds): 150pF@30V; Operating Temperature: -55℃~+150℃
R20 = TC0325D5623T5E: 电阻类型:薄膜电阻;阻值:562kΩ;精度:±0.5%;功率:166.667mW;最大工作电压:75V;温度系数:±25ppm/℃;; LCSC Part Name: 562kΩ ±0.5% 166.667mW 薄膜电阻; Supplier Part: C51262; Manufacturer: UNI-ROYAL(厚声); Supplier Footprint: 0603; JLCPCB Part Class: Extended Part; Datasheet: https://atta.szlcsc.com/upload/public/pdf/source/20190904/C425668_F2F639A313B6F33D501F342892FD5229.pdf; Supplier: LCSC; Type: 薄膜电阻; Tolerance: ±0.5%; Power(Watts): 166.667mW; Overload Voltage (Max): 75V; Temperature Coefficient: ±25ppm/℃; Operating Temperature Range: -55℃~+155℃
R21 = RC0603FR-07140KL: 电阻类型:厚膜电阻;阻值:140kΩ;精度:±1%;功率:100mW;最大工作电压:75V;温度系数:±100ppm/℃;; LCSC Part Name: 厚膜电阻 140kΩ ±1% 100mW; Supplier Part: C185372; Manufacturer: YAGEO(国巨); Supplier Footprint: 0603; JLCPCB Part Class: Extended Part; Datasheet: https://atta.szlcsc.com/upload/public/pdf/source/20180904/C276339_014E484F1DBA106FB92D45EABD5A1AC1.pdf; Supplier: LCSC; Type: 厚膜电阻; Tolerance: ±1%; Power(Watts): 100mW; Overload Voltage (Max): 75V; Temperature Coefficient: ±100ppm/℃; Operating Temperature Range: -55℃~+155℃
R25 = AC0603FR-07133KL: 电阻类型:厚膜电阻;阻值:133kΩ;精度:±1%;功率:100mW;最大工作电压:75V;温度系数:±100ppm/℃;; LCSC Part Name: 厚膜电阻 133kΩ ±1% 100mW; Supplier Part: C227577; Manufacturer: YAGEO(国巨); Supplier Footprint: 0603; JLCPCB Part Class: Extended Part; Datasheet: https://atta.szlcsc.com/upload/public/pdf/source/20180927/C229861_4ABDC471507C1ED6AFB4BA66AFC8620A.pdf; Supplier: LCSC; Type: 厚膜电阻; Tolerance: ±1%; Power(Watts): 100mW; Overload Voltage (Max): 75V; Temperature Coefficient: ±100ppm/℃; Operating Temperature Range: -55℃~+155℃
R27-R29 R31-R33 R47-R49 R51-R53 = 0603WAJ022JT5E: 电阻类型:厚膜电阻;阻值:2.2Ω;精度:±5%;功率:100mW;最大工作电压:75V;温度系数:±200ppm/℃;; LCSC Part Name: 2.2Ω ±5% 100mW 厚膜电阻; Supplier Part: C25226; Manufacturer: UNI-ROYAL(厚声); Supplier Footprint: 0603; JLCPCB Part Class: Extended Part; Datasheet: https://atta.szlcsc.com/upload/public/pdf/source/20200306/C422600_1E6D84923E4A46A82E41ADD87F860B5C.pdf; Supplier: LCSC; Type: 厚膜电阻; Tolerance: ±5%; Power(Watts): 100mW; Overload Voltage (Max): 75V; Temperature Coefficient: ±200ppm/℃; Operating Temperature Range: -55℃~+155℃
R30 R46 = ARG03FTC1802: 电阻类型:薄膜电阻;阻值:18kΩ;精度:±1%;功率:100mW;最大工作电压:75V;温度系数:±25ppm/℃;; LCSC Part Name: 薄膜电阻 18kΩ ±1% 100mW; Supplier Part: C217831; Manufacturer: Viking(光颉); Supplier Footprint: 0603; JLCPCB Part Class: Extended Part; Datasheet: https://atta.szlcsc.com/upload/public/pdf/source/20200117/C485675_99063924B4564AF910B7BE66DA8EFA49.pdf; Supplier: LCSC; Type: 薄膜电阻; Tolerance: ±1%; Power(Watts): 100mW; Overload Voltage (Max): 75V; Temperature Coefficient: ±25ppm/℃; Operating Temperature Range: -55℃~+155℃
R34 R35 R56 R57 = LRAN25GFER0005S: 电阻类型:采样电阻;阻值:0.5mΩ;精度:±1%;功率:3W;; LCSC Part Name: 0.5mΩ ±1% 3W; Supplier Part: C5121028; Manufacturer: NCT(利昇达); Supplier Footprint: 2512; JLCPCB Part Class: Extended Part; Datasheet: https://atta.szlcsc.com/upload/public/pdf/source/20220802/2693C2EE618FE3489E564C832611E315.pdf; Supplier: LCSC; Type: 采样电阻; Tolerance: ±1%; Power(Watts): 3W
R39 = RC0603FR-07365KL: 电阻类型:厚膜电阻;阻值:365kΩ;精度:±1%;功率:100mW;最大工作电压:75V;温度系数:±100ppm/℃;; LCSC Part Name: 厚膜电阻 365kΩ ±1% 100mW; Supplier Part: C185336; Manufacturer: YAGEO(国巨); Supplier Footprint: 0603; JLCPCB Part Class: Extended Part; Datasheet: https://atta.szlcsc.com/upload/public/pdf/source/20180904/C276339_014E484F1DBA106FB92D45EABD5A1AC1.pdf; Supplier: LCSC; Type: 厚膜电阻; Tolerance: ±1%; Power(Watts): 100mW; Overload Voltage (Max): 75V; Temperature Coefficient: ±100ppm/℃; Operating Temperature Range: -55℃~+155℃
R40 = RMC 0603 52K3 F N: 阻值:52.3kΩ;精度:±1%;功率:100mW;; LCSC Part Name: 52.3kΩ ±1% 100mW; Supplier Part: C325624; Manufacturer: Tyohm(幸亚电阻); Supplier Footprint: 0603; JLCPCB Part Class: Extended Part; Datasheet: https://atta.szlcsc.com/upload/public/pdf/source/20190115/C325956_D27151D492FFB3C9AB4A6F14FE01F30A.pdf; Supplier: LCSC; Tolerance: ±1%; Power(Watts): 100mW
R41 = RM06FTN8662: 电阻类型:厚膜电阻;阻值:86.6kΩ;精度:±1%;功率:100mW;最大工作电压:75V;温度系数:±100ppm/℃;; LCSC Part Name: 厚膜电阻 86.6kΩ ±1% 100mW; Supplier Part: C188033; Manufacturer: 大毅科技; Supplier Footprint: 0603; JLCPCB Part Class: Extended Part; Datasheet: https://atta.szlcsc.com/upload/public/pdf/source/20180912/C193177_4BB6657F58E460C8C6C7C234EECF646B.pdf; Supplier: LCSC; Type: 厚膜电阻; Tolerance: ±1%; Power(Watts): 100mW; Overload Voltage (Max): 75V; Temperature Coefficient: ±100ppm/℃; Operating Temperature Range: -55℃~+155℃
RN1 RN2 = RC-ML08W101JT: 电阻器数:4;阻值:100Ω;精度:±5%;单个元件功率:62.5mW;温度系数:±100ppm/℃;; LCSC Part Name: 100Ω ±5%; Supplier Part: C79203; Manufacturer: FH(风华); Supplier Footprint: 0603x4; JLCPCB Part Class: Extended Part; Datasheet: https://atta.szlcsc.com/upload/public/pdf/source/20140224/1457706855019.pdf; Supplier: LCSC; Number of Resistors: 4; Tolerance: ±5%; Power(Watts): 62.5mW; Temperature Coefficient: ±100ppm/℃; Number of Pins: 8
RT1 RT2 = NCP18XH103F03RB: 阻值(25℃):10kΩ;B值(25℃/50℃):3380K;电阻精度:±1%;功率:100mW;B值精度:±1%;最大稳态电流(25℃):310uA;; LCSC Part Name: 10kΩ 电阻精度:±1% 3380K; Supplier Part: C13564; Manufacturer: muRata(村田); Supplier Footprint: 0603; JLCPCB Part Class: Extended Part; Datasheet: https://atta.szlcsc.com/upload/public/pdf/source/20130819/1457706638081.pdf; Supplier: LCSC; Resistance @ 25℃: 10kΩ; B Constant (25℃/50℃): 3380K; Resistance Tolerance: ±1%; B Constant (25℃/85℃): 3434K; B Constant (25℃/100℃): 3455K; Power: 100mW; B Constant Tolerance: ±1%; Steady State Current (Max): 310uA; Operating Temperature: -40℃~+125℃
U6 U7 = DRV8301DCAR: DRV8301 具有降压稳压器、电流分流放大器和 SPI 的最大 65V 三相栅极驱动器; LCSC Part Name: 无刷直流BLDC电机驱动芯片 60V; Supplier Part: C98969; Manufacturer: TI(德州仪器); Supplier Footprint: HTSSOP-56-6mm; JLCPCB Part Class: Extended Part; Datasheet: https://www.ti.com/cn/lit/gpn/drv8301; Supplier: LCSC; JLCPCB SMD: Yes

## Nets
5V: C36.2 C37.2 C40.2 C66.2 CN3.1 CN5.1 D1.1(K) L2.2 P1.2(5V) P1.4(5V) R40.1 TP5.1 U4.1(VIN) U4.3(EN) U5.1(IN) U5.3(EN)
12V: C43.2 L1.2 PIN1.1 R21.1 TP6.1
AVCC: C20.2 C35.2 PIN6.1 RT1.2 RT2.2 TP4.1 U5.5(OUT) U6.24(REF) U7.24(REF) U8.21(VREF+) U8.22(VDDA)
GND: C1.2 C2.1 C3.1 C4.1 C5.2 C6.2 C7.2 C8.1 C9.2 C10.1 C11.1 C12.2 C13.1 C14.1 C15.1 C16.1 C17.1 C18.1 C19.1 C20.1 C21.2 C22.2 C24.1 C35.1 C36.1 C37.1 C38.1 C39.1 C40.1 C41.1 C43.1 C44.1 C48.1 C49.1 C50.1 C51.1 C55.2 C56.1 C58.1 C59.1 C61.1 C65.1 C66.1 C67.1 C71.1 C72.1 C73.1 C76.1 C79.2 C81.1 C82.1 C83.1 C86.1 CN1.4 CN1.5 CN1.6 CN2.0 CN3.0 CN3.4 CN4.6 CN4.7 CN4.8 CN5.0 CN5.4 CN6.6 CN6.7 CN6.8 CN7.5 CN8.5 D3.2(A) D4.2(A) H1.4 LED1.2 P1.6(GND) P1.9(GND) P1.14(GND) P1.20(GND) P1.25(GND) P1.30(GND) P1.34(GND) P1.39(GND) P2.6(GND) P2.9(GND) P2.14(GND) P2.20(GND) P2.25(GND) P2.30(GND) P2.34(GND) P2.39(GND) PIN5.1 Q1.2(E) R5.2 R12.2 R19.2 R20.2 R26.2 R30.2 R36.2 R39.2 R42.2 R46.2 R55.2 SW1.7(EP) SW1.8(EP) SW2.1 TFT1.8(GND) TFT1.13(GND) U1.3(GND) U1.11(EP) U2.4(GND) U3.2(GND) U4.2(GND) U5.2(GND) U6.28(AGND) U6.57(EP) U7.28(AGND) U7.57(EP) U8.10(VSS) U8.20(VSSA) U8.27(VSS) U8.74(VSS) U8.99(VSS) USBC1.0 USBC1.A1(GND) USBC1.A12(GND) USBC1.B1(GND) USBC1.B12(GND) X1.2(VSS)
PGND: C25.2 C26.2 C27.2 C28.2 C29.2 C30.2 C31.2 C32.2 C33.2 C34.2 C42.1 C45.1 C62.1 C63.1 C64.1 C68.1 C84.1 C85.1 D2.2 H2.1 Q5.1(S) Q5.2(S) Q5.3(S) Q13.1(S) Q13.2(S) Q13.3(S) R18.1 R19.1 R34.1 R35.1 R56.1 R57.1 RN1.1 RN1.3 RN2.1 RN2.3 U6.44(SL-A) U7.44(SL-A)
VBUS_S: C4.2 R2.2 R5.1 U8.31(PA6)
VCC: C2.2 C3.2 C8.2 C13.2 C14.2 C15.2 C16.2 C17.2 C18.2 C19.2 C39.2 CN1.1 CN4.1 CN6.1 CN7.1 CN8.1 H1.1 R10.2 R17.1 R22.1 R23.1 R24.1 R43.1 R44.1 R45.1 SW1.5(COM) TFT1.10(VCC) TFT1.12(VCC) TP3.1 U1.7(VCC) U1.10(V3) U2.3(/WP) U2.7(/HOLD) U2.8(VCC) U3.3(VCC) U4.5(VOUT) U6.49(VDD-SPI) U7.49(VDD-SPI) U8.6(VBAT) U8.11(VDD) U8.19(VDD) U8.28(VDD) U8.50(VDD) U8.75(VDD) U8.100(VDD)
_GPIO_1: CN1.3 P1.10(RXD/PA10) R1.1
_GPIO_2: CN1.2 P1.8(TXD/PA9) R3.1
_GPIO_3: CN3.2 P1.12(PCM_SCLK/PI5) R7.1
_GPIO_4: CN5.2 P1.16(GPIOH_14/PH14) R8.1
_GPIO_5: CN4.2 P1.18(GPIOC_7/PC7) R11.1
_GPIO_6: CN6.2 P1.7(PA8) R13.1
_GPIO_7: CN3.3 P1.22(GPIOC_6/PC6) R14.1
_GPIO_8: CN5.3 P1.24(NSS/PI0) R16.1
_USB_DM: R6.2 USBC1.B7(DN2)
_USB_DP: R4.2 USBC1.B6(DP2)
AUX_H: PIN4.1 U8.48(PB11)
AUX_L: PIN2.1 U8.47(PB10)
AUX_TEMP: PIN3.1 U8.30(PA5)
BOOT0: R12.1 U8.94(BOOT0)
CAN_D: U3.1(D) U8.96(PB9)
CAN_H: CN2.1 R9.1 U3.7(CANH)
CAN_L: CN2.2 R9.2 U3.6(CANL)
CAN_R: U3.4(R) U8.95(PB8)
DCBUS: C23.2 C25.1 C26.1 C27.1 C28.1 C29.1 C30.1 C31.1 C32.1 C33.1 C34.1 C45.2 C62.2 C63.2 C68.2 C84.2 C85.2 D2.1 H2.2 Q2.5(D) Q2.6(D) Q2.7(D) Q2.8(D) Q3.5(D) Q3.6(D) Q3.7(D) Q3.8(D) Q4.5(D) Q4.6(D) Q4.7(D) Q4.8(D) Q8.5(D) Q8.6(D) Q8.7(D) Q8.8(D) Q9.5(D) Q9.6(D) Q9.7(D) Q9.8(D) Q10.5(D) Q10.6(D) Q10.7(D) Q10.8(D) R2.1 U6.29(PVDD1) U6.53(PVDD2) U6.54(PVDD2) U7.29(PVDD1) U7.53(PVDD2) U7.54(PVDD2)
EN_GATE: TP1.1 U6.16(EN-GATE) U7.16(EN-GATE) U8.51(PB12)
FLASH_NCS: U2.1(/CS) U8.38(PE7)
FREEIO_1: P2.19(PC5_ETH_RXD1) U8.84(PD3)
FREEIO_2: P2.18(ETH_RXD0/PC4) U8.85(PD4)
FREEIO_3: P2.12(ETH_MDC/PC1) U8.86(PD5)
FREEIO_4: P2.10(FDCAN1_RX/PB8) U8.87(PD6)
FREEIO_5: P2.8(ETH_TXD1/PG14) U8.88(PD7)
FREEIO_6: P2.5(PG13/ETH_TXD0) U8.97(PE0)
FREEIO_7: P2.3(PG11/ETH_TX_EN) U8.98(PE1)
FREEIO_8: P2.24(ETH_MDIO/PA2) U8.81(PD0)
FREEIO_9: P2.22(ETH_REF_CLK/PA1) U8.82(PD1)
FREEIO_10: P1.28(GPIOH_8/PH8) U8.55(PD8)
FREEIO_11: P1.23(PI1/SCLK) U8.56(PD9)
FREEIO_12: P1.26(GPIOG_7/PG7) U8.57(PD10)
FREEIO_13: P1.21(PI2/MISO) U8.58(PD11)
FREEIO_14: P1.19(PI3/MOSI) U8.59(PD12)
GPIO_1: C1.1 R1.2 U1.9(RXD) U8.23(PA0-WKUP(PA0))
GPIO_2: C5.1 R3.2 U1.8(TXD) U8.24(PA1)
GPIO_3: C6.1 R7.2 U8.25(PA2)
GPIO_4: C7.1 R8.2 U8.26(PA3)
GPIO_5: C9.1 R11.2 U8.33(PC4)
GPIO_6: C12.1 R13.2 U8.37(PB2-BOOT1(PB2))
GPIO_7: C21.1 R14.2 U8.77(PA15(JTDI))
GPIO_8: C22.1 R16.2 U8.89(PB3(JTDOTRACESWO))
GVDD: C51.2 U6.13(GVDD)
GVDD2: C76.2 U7.13(GVDD)
M0_AH: U6.17(INH-A) U8.67(PA8)
M0_AL: U6.18(INL-A) U8.52(PB13)
M0_BH: U6.19(INH-B) U8.68(PA9)
M0_BL: U6.20(INL-B) U8.53(PB14)
M0_CH: U6.21(INH-C) U8.69(PA10)
M0_CL: U6.22(INL-C) U8.54(PB15)
M0_ENC_A: C50.2 CN7.2 R24.2 U8.90(PB4(NJTRST))
M0_ENC_B: C49.2 CN7.3 R23.2 U8.91(PB5)
M0_ENC_Z: C48.2 CN7.4 R22.2 U8.66(PC9)
M0_GH_A: R27.2 U6.47(GH-A)
M0_GH_B: R28.2 U6.42(GH-B)
M0_GH_C: R29.2 U6.37(GH-C)
M0_GL_A: R31.2 U6.45(GL-A)
M0_GL_B: R32.2 U6.40(GL-B)
M0_GL_C: R33.2 U6.35(GL-C)
M0_NCS: U6.8(NSCS) U8.7(PC13)
M0_SH_A: C47.2 H4.1 Q2.1(S) Q2.2(S) Q2.3(S) Q5.5(D) Q5.6(D) Q5.7(D) Q5.8(D) U6.46(SH-A)
M0_SH_B: C53.2 H4.2 Q3.1(S) Q3.2(S) Q3.3(S) Q6.5(D) Q6.6(D) Q6.7(D) Q6.8(D) U6.41(SH-B)
M0_SH_C: C54.2 H4.3 Q4.1(S) Q4.2(S) Q4.3(S) Q7.5(D) Q7.6(D) Q7.7(D) Q7.8(D) U6.36(SH-C)
M0_SL_B: Q6.1(S) Q6.2(S) Q6.3(S) R34.2 RN1.4 U6.39(SL-B)
M0_SL_C: Q7.1(S) Q7.2(S) Q7.3(S) R35.2 RN1.2 U6.34(SL-C)
M0_SO1: C58.2 R37.2 U8.15(PC0)
M0_SO2: C59.2 R38.2 U8.16(PC1)
M0_TEMP: C56.2 R36.1 RT1.1 U8.34(PC5)
M1_AH: U7.17(INH-A) U8.63(PC6)
M1_AL: U7.18(INL-A) U8.32(PA7)
M1_BH: U7.19(INH-B) U8.64(PC7)
M1_BL: U7.20(INL-B) U8.35(PB0)
M1_CH: U7.21(INH-C) U8.65(PC8)
M1_CL: U7.22(INL-C) U8.36(PB1)
M1_ENC_A: C71.2 CN8.2 R43.2 U8.92(PB6)
M1_ENC_B: C72.2 CN8.3 R44.2 U8.93(PB7)
M1_ENC_Z: C73.2 CN8.4 R45.2 U8.9(PC15-OSC32_OUT(PC15))
M1_GH_A: R49.2 U7.47(GH-A)
M1_GH_B: R48.2 U7.42(GH-B)
M1_GH_C: R47.2 U7.37(GH-C)
M1_GL_A: R53.2 U7.45(GL-A)
M1_GL_B: R52.2 U7.40(GL-B)
M1_GL_C: R51.2 U7.35(GL-C)
M1_NCS: U7.8(NSCS) U8.8(PC14-OSC32_IN(PC14))
M1_SH_A: C70.1 H5.1 Q10.1(S) Q10.2(S) Q10.3(S) Q13.5(D) Q13.6(D) Q13.7(D) Q13.8(D) U7.46(SH-A)
M1_SH_B: C74.1 H5.2 Q9.1(S) Q9.2(S) Q9.3(S) Q12.5(D) Q12.6(D) Q12.7(D) Q12.8(D) U7.41(SH-B)
M1_SH_C: C77.1 H5.3 Q8.1(S) Q8.2(S) Q8.3(S) Q11.5(D) Q11.6(D) Q11.7(D) Q11.8(D) U7.36(SH-C)
M1_SL_B: Q12.1(S) Q12.2(S) Q12.3(S) R57.2 RN2.4 U7.39(SL-B)
M1_SL_C: Q11.1(S) Q11.2(S) Q11.3(S) R56.2 RN2.2 U7.34(SL-C)
M1_SO1: C83.2 R50.2 U8.18(PC3)
M1_SO2: C82.2 R54.2 U8.17(PC2)
M1_TEMP: C81.2 R55.1 RT2.1 U8.29(PA4)
NFAULT: TP2.1 U6.6(NFAULT) U7.6(NFAULT) U8.83(PD2)
NRST: C24.2 P1.11(PA15/GPIOA_15) R17.2 SW2.2 U8.14(NRST)
OSC_IN: U8.12(PH0-OSC_IN(PH0)) X1.1
OSC_OUT: U8.13(PH1-OSC_OUT(PH1)) X1.3
SPI_MISO: CN4.4 CN6.4 U2.2(DO) U6.10(SDO) U7.10(SDO) U8.79(PC11)
SPI_MOSI: CN4.5 CN6.5 U2.5(DI) U6.9(SDI) U7.9(SDI) U8.80(PC12)
SPI_SCK: CN4.3 CN6.3 U2.6(CLK) U6.11(SCLK) U7.11(SCLK) U8.78(PC10)
SRC_BL: Q1.1(B) U8.46(PE15)
SRC_CS: TFT1.7(CS) U8.42(PE11)
SRC_DC: TFT1.5(DC) U8.40(PE9)
SRC_RES: TFT1.6(RES) U8.41(PE10)
SRC_SCL: TFT1.4(SCL) U8.43(PE12)
SRC_SDA: TFT1.3(SDA) U8.45(PE14)
SW_D: SW1.3(C) U8.1(PE2)
SW_KEY: SW1.2(KEY) U8.5(PE6)
SW_L: SW1.1(A) U8.4(PE5)
SW_R: SW1.6(D) U8.2(PE3)
SW_U: SW1.4(B) U8.3(PE4)
SWCLK: H1.3 U8.76(PA14(JTCK-SWCLK))
SWDIO: H1.2 U8.72(PA13(JTMS-SWDIO))
USB_DM: R6.1 U8.70(PA11)
USB_DP: R4.1 U8.71(PA12)
VUSB: F1.2 USBC1.A4(VBUS) USBC1.A9(VBUS) USBC1.B4(VBUS) USBC1.B9(VBUS)
$2N12384: R15.2 TFT1.11(LEDK)
$2N12415: LED1.1 R10.1
$2N12417: C10.2 U8.73(VCAP_2)
$2N12418: C11.2 U8.49(VCAP_1)
$2N12745: Q1.3(C) R15.1
$2N12772: C23.1 R18.2
$2N12803: U1.2(UD-) USBC1.A7(DN1)
$2N12804: U1.1(UD+) USBC1.A6(DP1)
$2N26582: D1.2(A) F1.1
$2N26648: C38.2 U4.4(BP)
$3N8656: Q2.4(G) R27.1
$3N8657: Q5.4(G) R31.1
$3N8669: Q6.4(G) R32.1
$3N8670: Q3.4(G) R28.1
$3N8677: Q7.4(G) R33.1
$3N8678: Q4.4(G) R29.1
$3N8709: C54.1 U6.38(BST-C)
$3N8710: C57.2 RN1.5 U6.33(SN1)
$3N8711: C60.1 RN1.7 U6.31(SN2)
$3N8712: C60.2 RN1.8 U6.30(SP2)
$3N8715: C61.2 U6.27(AVDD)
$3N8716: R37.1 U6.25(SO1)
$3N8717: R38.1 U6.26(SO2)
$3N8724: C55.1 U6.23(DVDD)
$3N8739: C52.2 U6.15(CP2)
$3N8740: C52.1 U6.14(CP1)
$3N8750: R30.1 U6.7(DTC)
$3N8752: R21.2 R26.1 U6.3(VSENSE)
$3N8756: R20.1 U6.1(RT-CLK)
$3N8759: C46.1 U6.52(BST-BK)
$3N8772: C57.1 RN1.6 U6.32(SP1)
$3N8786: C44.2 R25.2
$3N8810: C41.2 R25.1 U6.2(COMP)
$3N8812: C53.1 U6.43(BST-B)
$3N8813: C47.1 U6.48(BST-A)
$3N8818: C42.2 U6.56(SS-TR)
$3N8819: C46.2 D3.1(K) L1.1 U6.50(PH) U6.51(PH)
$3N8853: C78.2 RN2.5 U7.33(SN1)
$3N8854: C80.1 RN2.7 U7.31(SN2)
$3N8859: C86.2 U7.27(AVDD)
$3N8860: R50.1 U7.25(SO1)
$3N8861: R54.1 U7.26(SO2)
$3N8873: C75.1 U7.14(CP1)
$3N8883: R46.1 U7.7(DTC)
$3N8885: R40.2 R42.1 U7.3(VSENSE)
$3N8889: R39.1 U7.1(RT-CLK)
$3N8892: C69.1 U7.52(BST-BK)
$3N8899: C64.2 U7.56(SS-TR)
$3N8902: C80.2 RN2.8 U7.30(SP2)
$3N8903: C78.1 RN2.6 U7.32(SP1)
$3N8919: C67.2 R41.2
$3N8956: Q8.4(G) R47.1
$3N8957: Q11.4(G) R51.1
$3N8964: Q9.4(G) R48.1
$3N8965: Q12.4(G) R52.1
$3N8977: Q13.4(G) R53.1
$3N8978: Q10.4(G) R49.1
$3N8987: C65.2 R41.1 U7.2(COMP)
$3N8998: C79.1 U7.23(DVDD)
$3N8999: C75.2 U7.15(CP2)
$3N9000: C77.2 U7.38(BST-C)
$3N9001: C74.2 U7.43(BST-B)
$3N9002: C70.2 U7.48(BST-A)
$3N9003: C69.2 D4.1(K) L2.1 U7.50(PH) U7.51(PH)

Not connected (* = marked no-connect by the designer): CN7 6* 7*; CN8 6* 7*; P1 1(3V3)* 3(PH12/SDA.1)* 5(PH11/SCL.1)* 13(PH15/GPIOH_15)* 15(PH13/GPIOH_13)* 17(3V3)* 27(PD13/GPIOD_13)* 29(PH7)* 31(PH9)* 32(GPIOH_10/PH10)* 33(PB13/FDCAN2_TX)* 35(PI7/PCM_FS)* 36(FDCAN2_RX/PB12)* 37(PI4/PCM_MCLK)* 38(PCM_IN/PG10)* 40(PCM_OUT/PI6)*; P2 1(3V3)* 2(3V_BAT)* 4(V_REF+)* 7(PB9_FDCAN1_TX)* 11(PC2_C/ADC_C2)* 13(PC3_C/ADC_C3)* 15(PA0_C/ADC_A0)* 16(ADC_A1/PA1_C)* 17(3V3)* 21(PA7/ETH_CRS_DV)* 23(PA6/GPIOA_6)* 26(ETH_RESET/PA3)* 27(PA12/USB_OTG_P)* 28(USB_OTG_N/PA11)* 29(PE4/SPI4_NSS)* 31(PE5/SPI4_MISO)* 32(SPI4_SCK/PE2)* 33(PE6/SPI4_MOSI)* 35(PH2/GPIOH_2)* 36(GPIOH_3/PH3)* 37(PB1/GPIOB_1)* 38(GPIOB_0/PB0)* 40(GPIOB_2/PB2)*; TFT1 1(NC)* 2(NC)* 9(NC)*; U1 4(DTR#)* 5(CTS#)* 6(RTS#)*; U3 5(NC)* 8(NC)*; U5 4(N/C)*; U6 4(PWRGD)* 5(NOCTW)* 12(DC-CAL)* 55(EN-BUCK)*; U7 4(PWRGD)* 5(NOCTW)* 12(DC-CAL)* 55(EN-BUCK)*; U8 39(PE8)* 44(PE13)* 60(PD13)* 61(PD14)* 62(PD15)*; USBC1 A5(CC1)* A8(SBU1)* B5(CC2)* B8(SBU2)*

## Notes on the sheets
sheet 1
- 可选型号：
  STM32F405VGT6
  STM32F407VGT6
  STM32F415VGT6
  STM32F417VGT6
- 复用Type C通信接口
- SPI FLASH
- 电压采样
- CAN收发器
- AUX & CAN 接口
- 系统电源指示灯
- TIM_CH1
- TIM_CH2N
- 单片机最小系统
- 1.14' IPS屏幕
- 滤波电路
- Right  右
- UP 上
- Down 下
- center 中
- Left 左
- 电源
- 拓展接口
- 复位电路
- 五向开关
- GPIO
- Primary
- Step/Dir
- Analog/PWM
- This Project
- GPIO1
- UART TX
- Axis 0 Step
- Analog/PWM
- UART TX
- GPIO2
- UART RX
- Axis 0 Dir
- Analog/PWM
- UART RX
- GPIO3
- Analog/PWM
- Analog/PWM/Axis 1 Step
- GPIO4
- Analog/PWM
- Analog/PWM/Axis 0 Step
- GPIO5
- Analog
- SPI CS0
- GPIO6
- SPI CS1
- GPIO7
- Axis 1 Step
- Axis 1 Dir
- GPIO8
- Axis 1 Dir
- Axis 0 Dir
- 接口说明
- 测试点
- LOGO
- 主要接口
- 次要接口
sheet 2
- HALL传感器
- Motor0
- R
- DTC
- Dead Time (ns) =
- 150k
- 450 + 50
- HALL传感器
- Motor1
